# Altium schematic sheet [4]Communication.SchDoc
size A4; DocumentNumber: 5; SheetNumber: 5; SheetTotal: 5
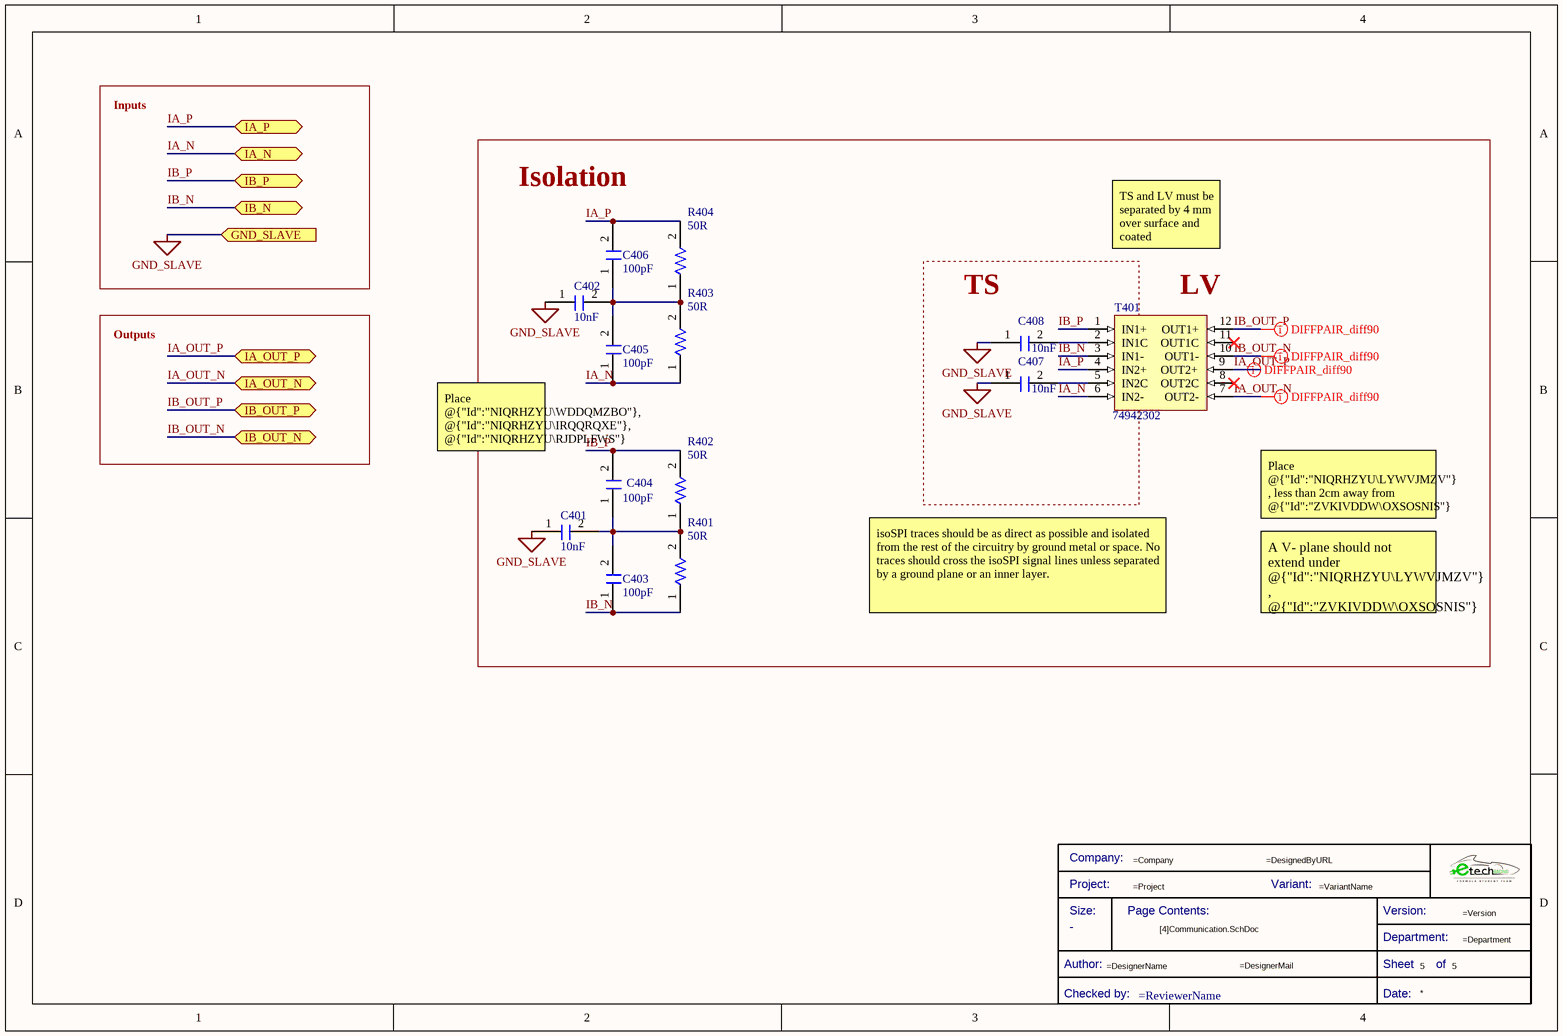
[diagram p0: [4]Communication.SchDoc]

## Parts
*?  Title Block_template  (value not drawn)  (graphical)
C401  Capacitance: 10nF  [C0805FNPC-R]  (hidden comment: 885012207122)
C402  Capacitance: 10nF  [C0805FNPC-R]  (hidden comment: 885012207122)
C403  Capacitance: 100pF  [C0805FNPC-W]  (hidden comment: 885012007082)
C404  Capacitance: 100pF  [C0805FNPC-W]  (hidden comment: 885012007082)
C405  Capacitance: 100pF  [C0805FNPC-W]  (hidden comment: 885012007082)
C406  Capacitance: 100pF  [C0805FNPC-W]  (hidden comment: 885012007082)
C407  Capacitance: 10nF  [C0805FNPC-R]  (hidden comment: 885012207122)
C408  Capacitance: 10nF  [C0805FNPC-R]  (hidden comment: 885012207122)
R401  50R  [R0805FTK]
R402  50R  [R0805FTK]
R403  50R  [R0805FTK]
R404  50R  [R0805FTK]
T401  74942302  [TFMR_74942302]

## Blocks framed on the sheet
TS: C407 C408

## Ports
GND_SLAVE (in), IA_N (bidir), IA_OUT_N (bidir), IA_OUT_P (bidir), IA_P (bidir), IB_N (bidir), IB_OUT_N (bidir), IB_OUT_P (bidir), IB_P (bidir)

## Nets
GND_SLAVE: C401.1 C402.1 C407.1 C408.1 ; port GND_SLAVE
IA_N: C405.1 R403.1 T401.6(IN2-) ; port IA_N
IA_OUT_N: T401.7(OUT2-) ; port IA_OUT_N
IA_OUT_P: T401.9(OUT2+) ; port IA_OUT_P
IA_P: C406.2 R404.2 T401.4(IN2+) ; port IA_P
IB_N: C403.1 R401.1 T401.3(IN1-) ; port IB_N
IB_OUT_N: T401.10(OUT1-) ; port IB_OUT_N
IB_OUT_P: T401.12(OUT1+) ; port IB_OUT_P
IB_P: C404.2 R402.2 T401.1(IN1+) ; port IB_P
NetC401_2: C401.2 C403.2 C404.1 R401.2 R402.1
NetC402_2: C402.2 C405.2 C406.1 R403.2 R404.1
NetC407_2: C407.2 T401.5(IN2C)
NetC408_2: C408.2 T401.2(IN1C)

Not connected (* = marked no-connect by the designer): T401 8(OUT2C)* 11(OUT1C)*

## Layout directives
differential pair; differential pair class diff90: IA_OUT_N, IA_OUT_P, IB_OUT_N, IB_OUT_P

## Notes on the sheet
- Inputs
- Isolation
- TS and LV must be separated by 4 mm over surface and coated
- (near T401) LV
- Outputs
- Place @{"Id":"NIQRHZYU\WDDQMZBO"}, @{"Id":"NIQRHZYU\IRQQRQXE"}, @{"Id":"NIQRHZYU\RJDPLFWS"} and @{"Id":"NIQRHZYU\UZNONKUP"} as close to @{"Id":"DMDIIFGR\EDJCIAWA"} as possible.
- Place @{"Id":"NIQRHZYU\LYWVJMZV"} , less than 2cm away from @{"Id":"ZVKIVDDW\OXSOSNIS"} and @{"Id":"ZVKIVDDW\EPOQRVEM"} . @{"Id":"DMDIIFGR\EDJCIAWA"} shoud be close but at lest 1-2 cm away from the @{"Id":"NIQRHZYU\LYWVJMZV"}
- isoSPI traces should be as direct as possible and isolated from the rest of the circuitry by ground metal or space. No traces should cross the isoSPI signal lines unless separated by a ground plane or an inner layer.
- A V- plane should not extend under @{"Id":"NIQRHZYU\LYWVJMZV"} , @{"Id":"ZVKIVDDW\OXSOSNIS"} , @{"Id":"ZVKIVDDW\EPOQRVEM"} or between them.
- (in symbol Title Block_template) Company:; Project:; Variant:; Size:; Page Contents:; Version:; Department:; Author:; Sheet; of; Checked by:; Date:

## Library data of the parts
*? = Title Block_template: Standard Title Block; .Creator: GP; Category: Title Block; .PCBcheck: GP; .SCHcheck: GP; Checked by:: =ReviewerName; Size: -
C401 C402 C407 C408 = C10n-100V-0805FNPC-X7R: Cap Cer 10000PF 100V X7R 0805; Manufacturer 1: Wurth Electronics; Manufacturer Part Number 1: 885012207092; Voltage Rating: 50V; Tolerance: 10%; .Creator: DR; Value: 10nF; Insulation Resistance: 10GR; Supplier 1: RSComponents; RoHS: Yes; Category: Ceramic Capacitors; Stock 1: 1; Pricing 1: 4000=0,03200, 12000=0,03100 (USD); Mount: Surface Mount; Case/Package: 0805; Case Code (Metric): 2012; Case Code (Imperial): 0805; Min Operating Temperature: -55°C; Max Operating Temperature: 125°C; Packaging: Cut Tape; Dielectric: X7R; Voltage Rating (DC): 50V; Length: 0.079inch; Width: 0.049inch; Thickness: 0.035inch; REACH SVHC: Unknown; RoHS Compliant: Yes; ComponentLink1URL: http://www.farnell.com/datasheets/1958497.pdf?src-supplier=Farnell; ComponentLink1Description: http://www.farnell.com/datasheets/1958497.pdf?src-supplier=Farnell; ComponentLink2URL: http://www.farnell.com/datasheets/1958497.pdf?src-supplier=Element14; ComponentLink2Description: http://www.farnell.com/datasheets/1958497.pdf?src-supplier=Element14; ComponentLink3URL: http://www.farnell.com/datasheets/1958497.pdf?src-supplier=Newark; ComponentLink3Description: http://www.farnell.com/datasheets/1958497.pdf?src-supplier=Newark; ComponentLink4URL: https://katalog.we-online.de/pbs/datasheet/885012207092.pdf?src-supplier=Digi-Key; ComponentLink4Description: https://katalog.we-online.de/pbs/datasheet/885012207092.pdf?src-supplier=Digi-Key; Supplier Part Number 1: 1813941; Supplier 2: Digi-Key; Manufacturer: Wurth Electronics; Manufacturer Part Number: 885012207122; Stock 2: 7435; Pricing 2: 1=0,1, 10=0,043, 100=0,039, 500=0,034 (USD); Height: 800um; ComponentLink5URL: http://www.farnell.com/datasheets/2546912.pdf?src-supplier=Farnell; ComponentLink5Description: http://www.farnell.com/datasheets/2546912.pdf?src-supplier=Farnell; ComponentLink6URL: http://www.farnell.com/datasheets/2546912.pdf?src-supplier=Newark; ComponentLink6Description: http://www.farnell.com/datasheets/2546912.pdf?src-supplier=Newark; ComponentLink7URL: https://katalog.we-online.de/pbs/datasheet/885012207122.pdf?src-supplier=Digi-Key; ComponentLink7Description: https://katalog.we-online.de/pbs/datasheet/885012207122.pdf?src-supplier=Digi-Key; Supplier Part Number 2: 732-12139-1-ND
C403-C406 = C100p-100V-0805FNPC-C0G/NP0: Cap Cer 100PF 100V C0G/NP0 0805; Manufacturer: Wurth Electronics; Manufacturer Part Number: 885012007057; Voltage Rating: 50V; Dielectric: C0G; Tolerance: 5%; .Creator: DR; Supplier 1: RSComponents; RoHS: Yes; Category: Ceramic Capacitors; Stock 1: 1; Pricing 1: 4000=0,03900, 12000=0,03800 (USD); Mount: Surface Mount; Case/Package: 0805; Case Code (Metric): 2012; Case Code (Imperial): 0805; Min Operating Temperature: -55°C; Max Operating Temperature: 125°C; Packaging: Cut Tape; Voltage Rating (DC): 50V; Length: 0.079inch; Width: 0.049inch; Thickness: 0.035inch; REACH SVHC: Unknown; RoHS Compliant: Yes; ComponentLink1URL: http://www.farnell.com/datasheets/1958443.pdf?src-supplier=Farnell; ComponentLink1Description: http://www.farnell.com/datasheets/1958443.pdf?src-supplier=Farnell; ComponentLink2URL: https://katalog.we-online.de/pbs/datasheet/885012007057.pdf?src-supplier=Digi-Key; ComponentLink2Description: https://katalog.we-online.de/pbs/datasheet/885012007057.pdf?src-supplier=Digi-Key; ComponentLink3URL: http://www.farnell.com/datasheets/1958443.pdf?src-supplier=Element14; ComponentLink3Description: http://www.farnell.com/datasheets/1958443.pdf?src-supplier=Element14; ComponentLink4URL: http://www.farnell.com/datasheets/1958443.pdf?src-supplier=Newark; ComponentLink4Description: http://www.farnell.com/datasheets/1958443.pdf?src-supplier=Newark; ComponentLink5Description: Where buy it; ComponentLink5URL: https://www.we-online.com/catalog/en/WCAP-CSGP-50VDC#885012007057; Supplier Part Number 1: 1813930; Supplier 2: Digi-Key; Stock 2: 3490; Pricing 2: 1=0,1, 10=0,066, 100=0,06, 500=0,053 (USD); ComponentLink6URL: https://katalog.we-online.de/pbs/datasheet/885012007082.pdf?src-supplier=Digi-Key; ComponentLink6Description: https://katalog.we-online.de/pbs/datasheet/885012007082.pdf?src-supplier=Digi-Key; Supplier Part Number 2: 732-12228-1-ND
R401-R404 = R50-0805FTK_1: Res Thick Film 0805 50 Ohm 1% 0.125W(1/8W) ±100ppm/C Pad SMD Automotive T/R; Manufacturer: Vishay Dale; Manufacturer Part Number: CRCW080550R0FKTA; Power Rating: 125mW; Voltage Rating: 150V; Temperature Coefficient: 100ppm/°C; Supplier 1: Mouser; RoHS: No; Category: Chip SMD Resistors; Stock 1: 38245; Pricing 1: 1=0,25, 10=0,204, 50=0,204, 100=0,08, 1000=0,033, 10000=0,026 (USD); ComponentLink1URL: https://datasheet.ciiva.com/48525/dcrcw-48525895.pdf?src-supplier=Avnet; ComponentLink1Description: https://datasheet.ciiva.com/48525/dcrcw-48525895.pdf?src-supplier=Avnet; Supplier Part Number 1: 71-CRCW0805-50; Case/Package: 0805; Weight: 0.000194oz; Case Code (Imperial): 0805; Case Code (Metric): 2012; Contact Plating: Tin,Lead; Min Operating Temperature: -55°C; Max Operating Temperature: 155°C; Value: 50R; Tolerance: 1%; Packaging: Tape and Reel; Package Quantity: 5000; Series: CRCW; Length: 2mm; Width: 1.25mm; Height: 0.45mm; Lead Free: Contains Lead; RoHS Compliant: No
T401 = TFMR_4300V_1min_74942302